# Altium schematic sheet Indicator.SchDoc
size A4
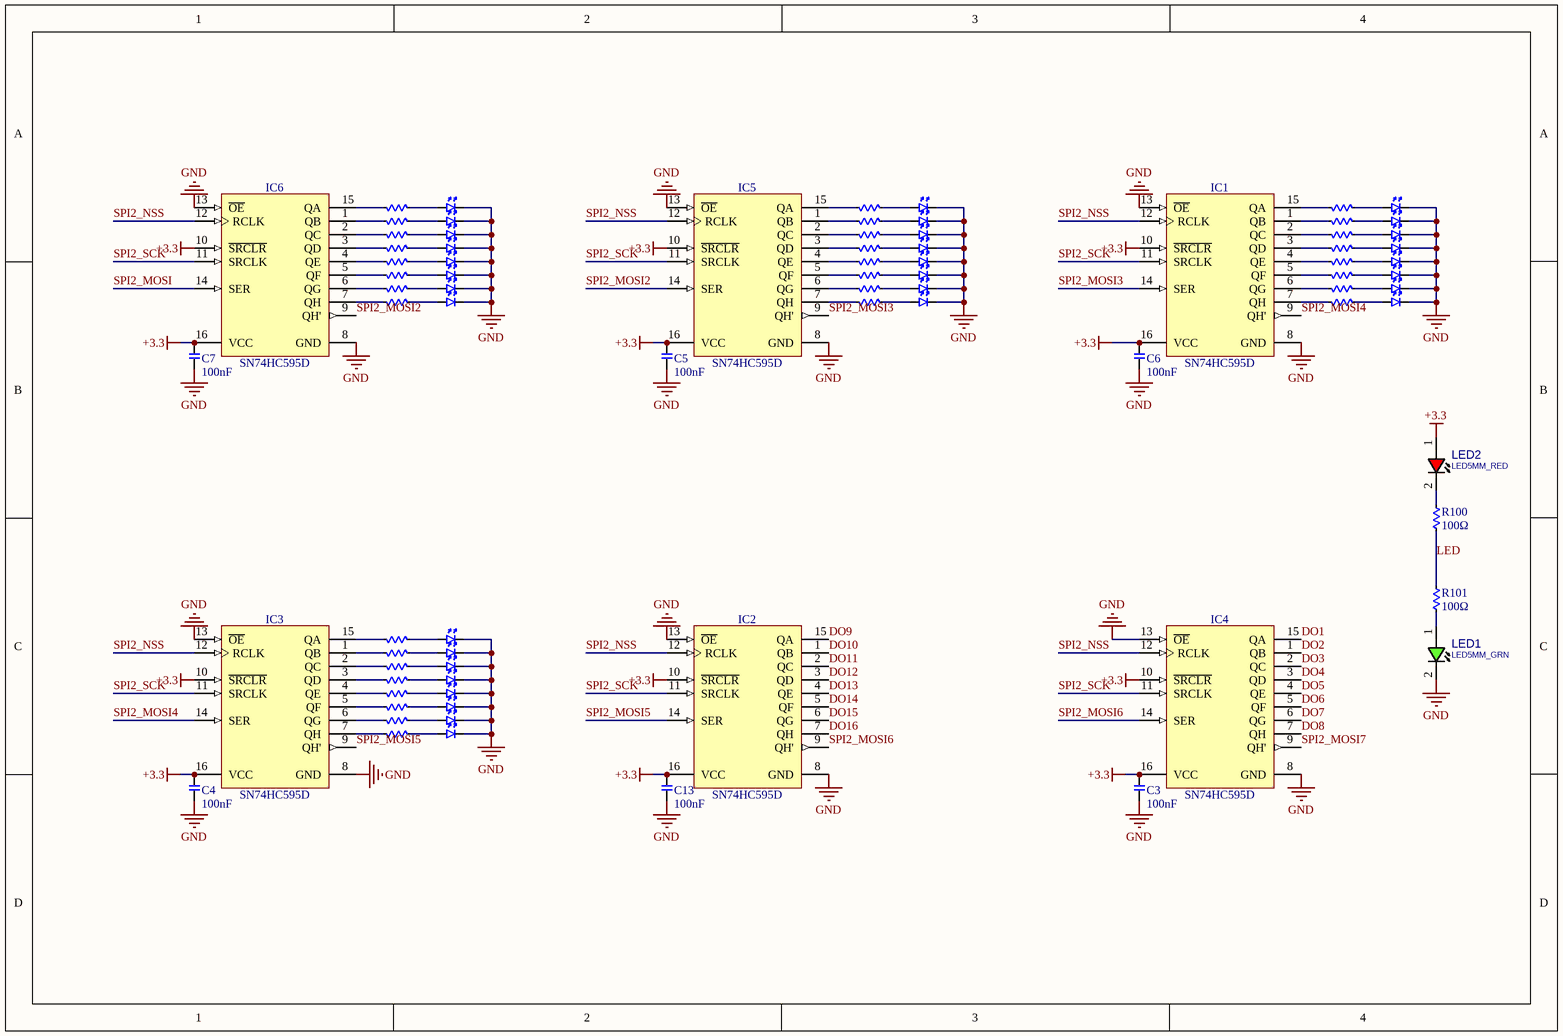
[diagram p0: Indicator.SchDoc]

## Parts
C3  100nF  [CAP_0603]
C4  100nF  [CAP_0603]
C5  100nF  [CAP_0603]
C6  100nF  [CAP_0603]
C7  100nF  [CAP_0603]
C13  100nF  [CAP_0603]
D2  LED  [LED 0603 GREEN]  (value not drawn)
D3  LED  [LED 0603 GREEN]  (value not drawn)
D4  LED  [LED 0603 GREEN]  (value not drawn)
D5  LED  [LED 0603 GREEN]  (value not drawn)
D6  LED  [LED 0603 GREEN]  (value not drawn)
D7  LED  [LED 0603 GREEN]  (value not drawn)
D8  LED  [LED 0603 GREEN]  (value not drawn)
D9  LED  [LED 0603 GREEN]  (value not drawn)
D10  LED  [LED 0603 GREEN]  (value not drawn)
D11  LED  [LED 0603 GREEN]  (value not drawn)
D12  LED  [LED 0603 GREEN]  (value not drawn)
D13  LED  [LED 0603 GREEN]  (value not drawn)
D14  LED  [LED 0603 GREEN]  (value not drawn)
D15  LED  [LED 0603 GREEN]  (value not drawn)
D16  LED  [LED 0603 GREEN]  (value not drawn)
D17  LED  [LED 0603 GREEN]  (value not drawn)
D20  LED  [LED 0603 GREEN]  (value not drawn)
D21  LED  [LED 0603 GREEN]  (value not drawn)
D22  LED  [LED 0603 GREEN]  (value not drawn)
D23  LED  [LED 0603 GREEN]  (value not drawn)
D24  LED  [LED 0603 GREEN]  (value not drawn)
D25  LED  [LED 0603 GREEN]  (value not drawn)
D26  LED  [LED 0603 GREEN]  (value not drawn)
D27  LED  [LED 0603 GREEN]  (value not drawn)
D28  LED  [LED 0603 GREEN]  (value not drawn)
D29  LED  [LED 0603 GREEN]  (value not drawn)
D30  LED  [LED 0603 GREEN]  (value not drawn)
D31  LED  [LED 0603 GREEN]  (value not drawn)
D32  LED  [LED 0603 GREEN]  (value not drawn)
D33  LED  [LED 0603 GREEN]  (value not drawn)
D34  LED  [LED 0603 GREEN]  (value not drawn)
D35  LED  [LED 0603 GREEN]  (value not drawn)
IC1  SN74HC595D  [SOIC127P600X175-16N]
IC2  SN74HC595D  [SOIC127P600X175-16N]
IC3  SN74HC595D  [SOIC127P600X175-16N]
IC4  SN74HC595D  [SOIC127P600X175-16N]
IC5  SN74HC595D  [SOIC127P600X175-16N]
IC6  SN74HC595D  [SOIC127P600X175-16N]
LED1  LED5MM_GRN  [LED5MM_GRN]
LED2  LED5MM_RED  [LED5MM_RED]
R20  100Ω  [RES ARRAY 4X0603 100]  (value not drawn)  (parts A,B,C,D of 4)
R21  100Ω  [RES ARRAY 4X0603 100]  (value not drawn)  (parts A,B,C,D of 4)
R22  100Ω  [RES ARRAY 4X0603 100]  (value not drawn)  (parts A,B,C,D of 4)
R23  100Ω  [RES ARRAY 4X0603 100]  (value not drawn)  (parts A,B,C,D of 4)
R25  100Ω  [RES ARRAY 4X0603 100]  (value not drawn)  (parts A,B,C,D of 4)
R26  100Ω  [RES ARRAY 4X0603 100]  (value not drawn)  (parts A,B,C,D of 4)
R27  100Ω  [RES ARRAY 4X0603 100]  (value not drawn)  (parts A,B,C,D of 4)
R28  100Ω  [RES ARRAY 4X0603 100]  (value not drawn)  (parts A,B,C,D of 4)
R100  100Ω  [RES 0603 100]
R101  100Ω  [RES 0603 100]

## Nets
+3.3: C3.1 C4.1 C5.1 C6.1 C7.1 C13.1 IC1.10(~{SRCLR}) IC1.16(VCC) IC2.10(~{SRCLR}) IC2.16(VCC) IC3.10(~{SRCLR}) IC3.16(VCC) IC4.10(~{SRCLR}) IC4.16(VCC) IC5.10(~{SRCLR}) IC5.16(VCC) IC6.10(~{SRCLR}) IC6.16(VCC) LED2.1(ANODE)
GND: C3.2 C4.2 C5.2 C6.2 C7.2 C13.2 D2.2 D3.2 D4.2 D5.2 D6.2 D7.2 D8.2 D9.2 D10.2 D11.2 D12.2 D13.2 D14.2 D15.2 D16.2 D17.2 D20.2 D21.2 D22.2 D23.2 D24.2 D25.2 D26.2 D27.2 D28.2 D29.2 D30.2 D31.2 D32.2 D33.2 D34.2 D35.2 IC1.8(GND) IC1.13(~{OE}) IC2.8(GND) IC2.13(~{OE}) IC3.8(GND) IC3.13(~{OE}) IC4.8(GND) IC4.13(~{OE}) IC5.8(GND) IC5.13(~{OE}) IC6.8(GND) IC6.13(~{OE}) LED1.2(CATHODE)
DO1: IC4.15(QA)
DO2: IC4.1(QB)
DO3: IC4.2(QC)
DO4: IC4.3(QD)
DO5: IC4.4(QE)
DO6: IC4.5(QF)
DO7: IC4.6(QG)
DO8: IC4.7(QH)
DO9: IC2.15(QA)
DO10: IC2.1(QB)
DO11: IC2.2(QC)
DO12: IC2.3(QD)
DO13: IC2.4(QE)
DO14: IC2.5(QF)
DO15: IC2.6(QG)
DO16: IC2.7(QH)
LED: R100.2 R101.1
SPI2_MOSI: IC6.14(SER)
SPI2_MOSI2: IC5.14(SER) IC6.9(QH')
SPI2_MOSI3: IC1.14(SER) IC5.9(QH')
SPI2_MOSI4: IC1.9(QH') IC3.14(SER)
SPI2_MOSI5: IC2.14(SER) IC3.9(QH')
SPI2_MOSI6: IC2.9(QH') IC4.14(SER)
SPI2_MOSI7: IC4.9(QH')
SPI2_NSS: IC1.12(RCLK) IC2.12(RCLK) IC3.12(RCLK) IC4.12(RCLK) IC5.12(RCLK) IC6.12(RCLK)
SPI2_SCK: IC1.11(SRCLK) IC2.11(SRCLK) IC3.11(SRCLK) IC4.11(SRCLK) IC5.11(SRCLK) IC6.11(SRCLK)
NetD2_1: D2.1 R20.4
NetD3_1: D3.1 R20.3
NetD4_1: D4.1 R20.2
NetD5_1: D5.1 R20.1
NetD6_1: D6.1 R21.4
NetD7_1: D7.1 R21.3
NetD8_1: D8.1 R21.2
NetD9_1: D9.1 R21.1
NetD10_1: D10.1 R22.4
NetD11_1: D11.1 R22.3
NetD12_1: D12.1 R22.2
NetD13_1: D13.1 R22.1
NetD14_1: D14.1 R23.4
NetD15_1: D15.1 R23.3
NetD16_1: D16.1 R23.2
NetD17_1: D17.1 R23.1
NetD20_1: D20.1 R25.1
NetD21_1: D21.1 R25.2
NetD22_1: D22.1 R25.3
NetD23_1: D23.1 R25.4
NetD24_1: D24.1 R26.1
NetD25_1: D25.1 R26.2
NetD26_1: D26.1 R26.3
NetD27_1: D27.1 R26.4
NetD28_1: D28.1 R27.1
NetD29_1: D29.1 R27.2
NetD30_1: D30.1 R27.3
NetD31_1: D31.1 R27.4
NetD32_1: D32.1 R28.1
NetD33_1: D33.1 R28.2
NetD34_1: D34.1 R28.3
NetD35_1: D35.1 R28.4
NetIC1_1: IC1.1(QB) R21.7
NetIC1_2: IC1.2(QC) R21.6
NetIC1_3: IC1.3(QD) R21.5
NetIC1_4: IC1.4(QE) R20.8
NetIC1_5: IC1.5(QF) R20.7
NetIC1_6: IC1.6(QG) R20.6
NetIC1_7: IC1.7(QH) R20.5
NetIC1_15: IC1.15(QA) R21.8
NetIC3_1: IC3.1(QB) R23.7
NetIC3_2: IC3.2(QC) R23.6
NetIC3_3: IC3.3(QD) R23.5
NetIC3_4: IC3.4(QE) R22.8
NetIC3_5: IC3.5(QF) R22.7
NetIC3_6: IC3.6(QG) R22.6
NetIC3_7: IC3.7(QH) R22.5
NetIC3_15: IC3.15(QA) R23.8
NetIC5_1: IC5.1(QB) R25.7
NetIC5_2: IC5.2(QC) R25.6
NetIC5_3: IC5.3(QD) R25.5
NetIC5_4: IC5.4(QE) R26.8
NetIC5_5: IC5.5(QF) R26.7
NetIC5_6: IC5.6(QG) R26.6
NetIC5_7: IC5.7(QH) R26.5
NetIC5_15: IC5.15(QA) R25.8
NetIC6_1: IC6.1(QB) R27.7
NetIC6_2: IC6.2(QC) R27.6
NetIC6_3: IC6.3(QD) R27.5
NetIC6_4: IC6.4(QE) R28.8
NetIC6_5: IC6.5(QF) R28.7
NetIC6_6: IC6.6(QG) R28.6
NetIC6_7: IC6.7(QH) R28.5
NetIC6_15: IC6.15(QA) R27.8
NetLED1_1: LED1.1(ANODE) R101.2
NetLED2_2: LED2.2(CATHODE) R100.1

## Library data of the parts
C3-C7 C13 = CAP 100nF
IC1-IC6 = SN74HC595D: 8-Bit Shift Register With 3-State Output Register; Part Description: 8-Bit Shift Register With 3-State Output Registers; Manufacturer: TEXAS INSTRUMENTS; PressFit: No; Bonding: No; Part Number: SN74HC595D; Component Kind: Standard; Component Type: Standard; Device: SN74HC595D; PackageDescription: SOIC 16, Pitch 1.27mm - Body 4x10mm, IPC Medium Density; Manufacturer Part Number: SN74HC595D; Pin Count: 16; Case: SOIC16; Mounted: Yes; Socket: No; SMD: Yes; Sense: No; ComponentHeight: 1.75mm; Author: CERN DEM JLC; HelpURL: \\cern.ch\dfs\Applications\Altium\Datasheets\SN74HC595D.pdf; CreateDate: 6/5/2012; LatestRevisionDate: 6/5/2012
LED1 = LED_THD_5MM_GRN: LED, THD, 5MM, GREEN; DESC: DESCRIPTION; MANF_P#: MANF_PART#; PARAM2: 2.2V; MANF: MANF; ASSEMBLY: ASSEMBLY; PRICE: PRICE; VALUE: LED5MM_GRN
LED2 = LED_THD_5MM_RED: LED, THD, 5MM, RED; DESC: DESCRIPTION; MANF_P#: MANF_PART#; PARAM2: 2.2V; MANF: MANF; ASSEMBLY: ASSEMBLY; PRICE: PRICE; VALUE: LED5MM_RED
R20-R23 R25-R28 = RES ARRAY 100
R100 R101 = RES 100